# EAGLE design 2mos9 (EAGLE 5.10)
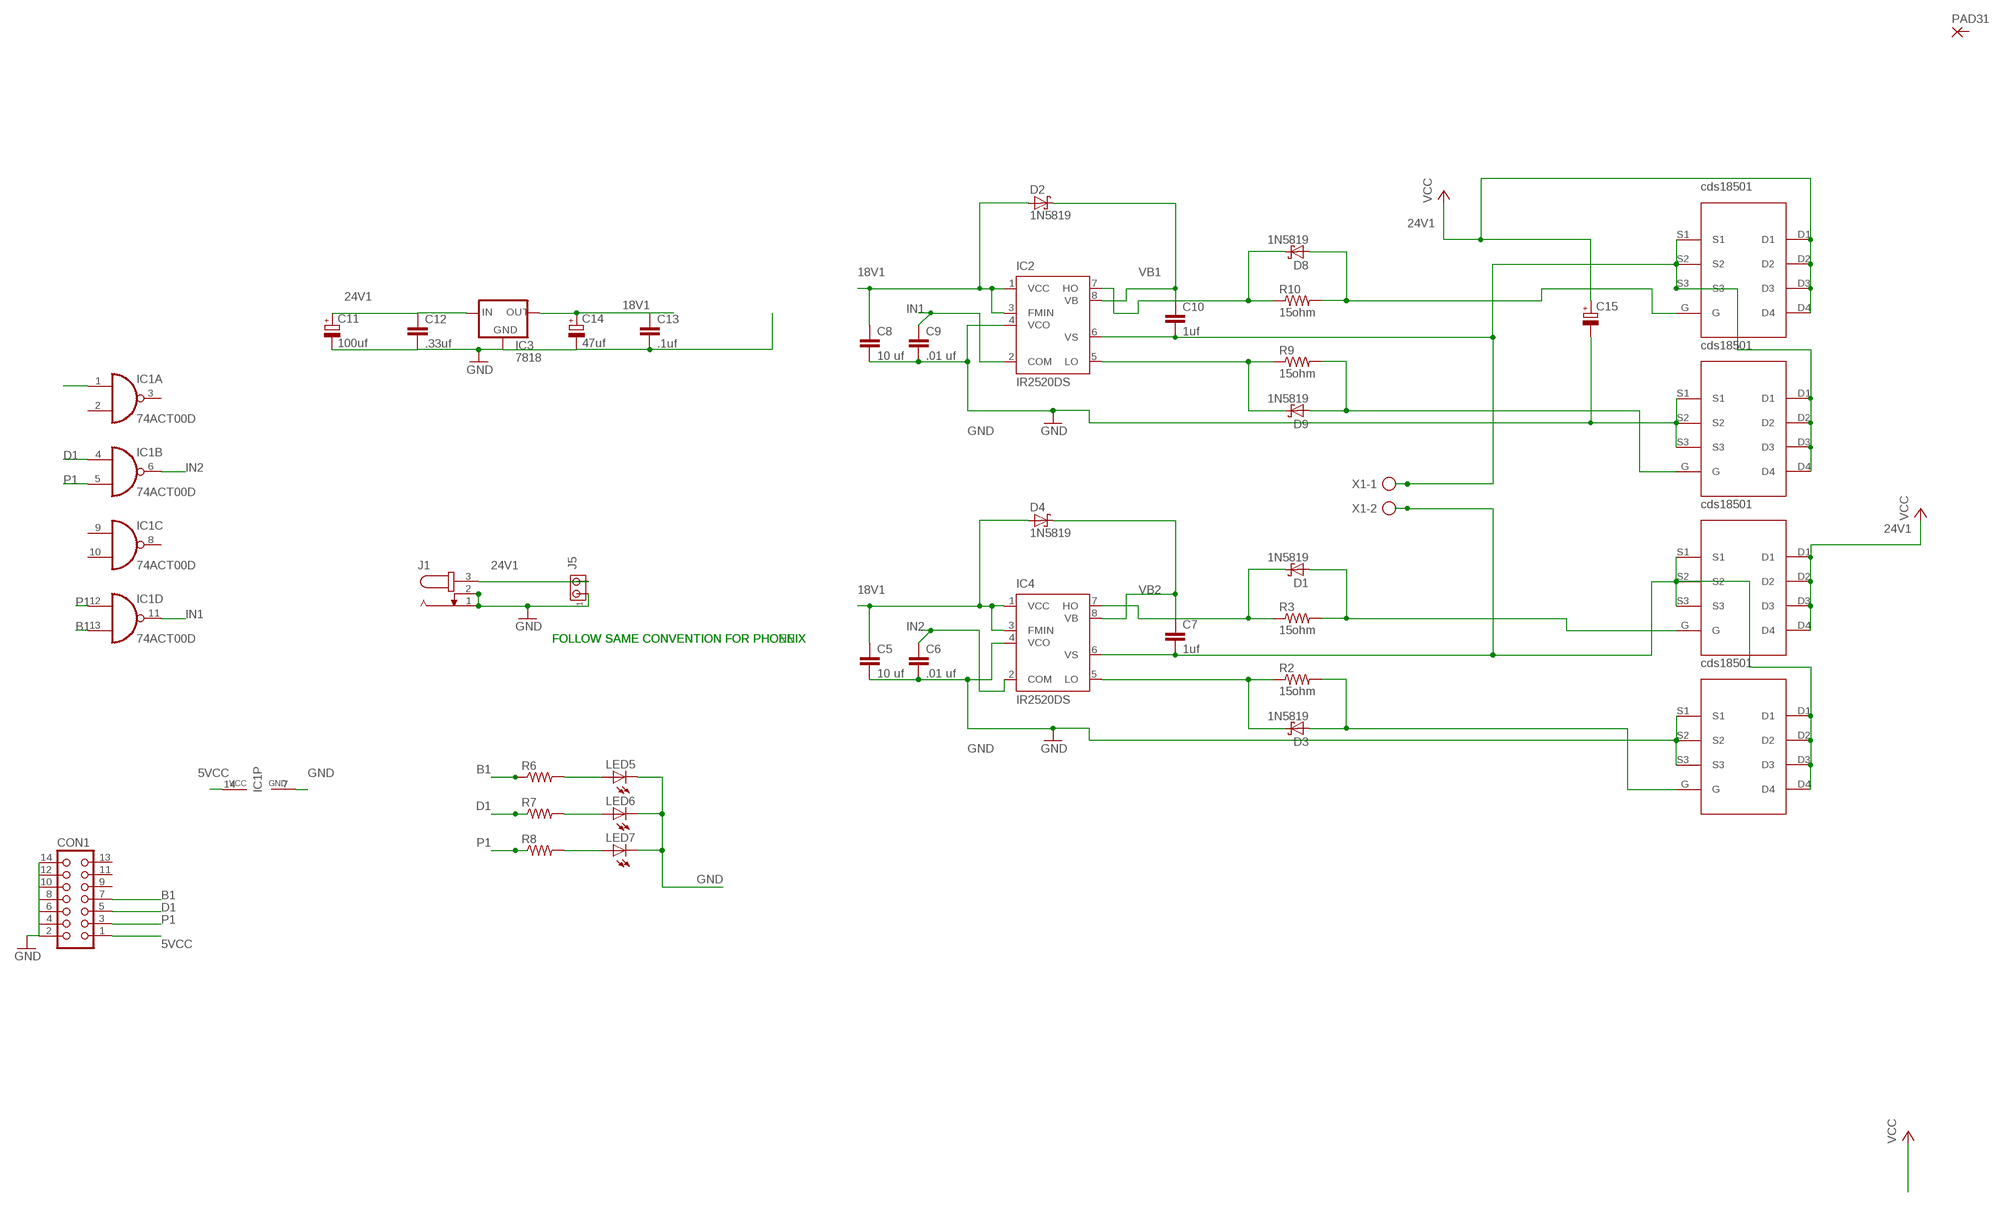
[diagram p0: schematic, sheet 1]

## Parts
C5  10 uf  C-EUC0603  [C0603]
C6  .01 uf  C-EUC0603  [C0603]
C7  1uf  C-EUC0603  [C0603]
C8  10 uf  C-EUC0603  [C0603]
C9  .01 uf  C-EUC0603  [C0603]
C10  1uf  C-EUC0603  [C0603]
C11  100uf  CPOL-EUE2.5-7  [E2,5-7]
C12  .33uf  C-EUC0603  [C0603]
C13  .1uf  C-EUC0603  [C0603]
C14  47uf  CPOL-EUE2.5-7  [E2,5-7]
C15  CPOL-EUE3.5-10  [E3,5-10]
CON1  CON14L  [CON14L]
D1  1N5819  SCHOTTKY-DIODESMD  [SMB]
D2  1N5819  SCHOTTKY-DIODESMD  [SMB]
D3  1N5819  SCHOTTKY-DIODESMD  [SMB]
D4  1N5819  SCHOTTKY-DIODESMD  [SMB]
D8  1N5819  SCHOTTKY-DIODESMD  [SMB]
D9  1N5819  SCHOTTKY-DIODESMD  [SMB]
IC1  74ACT00D  [SO14]
IC2  IR2520DS  [SO08]
IC3  7818  78XXS  [78XXS]
IC4  IR2520DS  [SO08]
J1  JACK-PLUG1  [SPC4078]
J5  MTA02-100  [10X02MTA]
LED5  LEDCHIPLED_0603  [CHIPLED_0603]
LED6  LEDCHIPLED_0603  [CHIPLED_0603]
LED7  LEDCHIPLED_0603  [CHIPLED_0603]
PAD31  1,6/0,8HOLE00  [1,6/0,8]
R2  15ohm  R-US_R0603  [R0603]
R3  15ohm  R-US_R0603  [R0603]
R6  R-US_R0603  [R0603]
R7  R-US_R0603  [R0603]
R8  R-US_R0603  [R0603]
R9  15ohm  R-US_R0603  [R0603]
R10  15ohm  R-US_R0603  [R0603]
U$1  CSD18503GDS-NEW  [CDS]
U$2  CSD18503GDS-NEW  [CDS]
U$3  CSD18503GDS-NEW  [CDS]
U$4  CSD18503GDS-NEW  [CDS]
X1  AK300/2  [AK300/2]

## Nets
5VCC: CON1.1 IC1.14(P:VCC)
18V1: C5.1 C8.1 C13.1 C14.+ D2.A D4.A IC2.1(VCC) IC2.3(FMIN) IC3.OUT IC4.1(VCC) IC4.3(FMIN)
24V1: C11.+ C12.1 C15.+ IC3.IN J1.3 J5.2 U$1.D1 U$1.D2 U$1.D3 U$1.D4 U$3.D1 U$3.D2 U$3.D3 U$3.D4 ; supply symbol labelled VCC
B1: CON1.7 IC1.13(D:I1) R6.1
D1: CON1.5 IC1.4(B:I0) R7.1
GND: C5.2 C6.2 C8.2 C9.2 C11.- C12.2 C13.2 C14.- C15.- CON1.2 CON1.4 CON1.6 CON1.8 CON1.10 CON1.12 CON1.14 IC1.7(P:GND) IC2.4(VCO) IC3.GND IC4.4(VCO) J1.1 J1.2 J5.1 LED5.C LED6.C LED7.C U$2.S1 U$2.S2 U$2.S3 U$4.S1 U$4.S2 U$4.S3
IN1: C9.1 IC1.11(D:O) IC2.2(COM)
IN2: C6.1 IC1.6(B:O) IC4.2(COM)
N$1: IC1.1(A:I0)
N$2: D3.C IC4.5(LO) R2.1
N$4: C7.2 IC4.6(VS) U$3.S1 U$3.S2 U$3.S3 U$4.D1 U$4.D2 U$4.D3 U$4.D4 X1.2
N$12: D8.A R10.2 U$1.G
N$13: D1.C IC4.7(HO) R3.1
N$14: D1.A R3.2 U$3.G
N$15: D3.A R2.2 U$4.G
N$17: C10.2 IC2.6(VS) U$1.S1 U$1.S2 U$1.S3 U$2.D1 U$2.D2 U$2.D3 U$2.D4 X1.1
N$23: D9.C IC2.5(LO) R9.1
N$24: D9.A R9.2 U$2.G
N$25: D8.C IC2.7(HO) R10.1
N$33: LED5.A R6.2
N$34: LED6.A R7.2
N$35: LED7.A R8.2
P1: CON1.3 IC1.5(B:I1) IC1.12(D:I0) R8.1
VB1: C10.1 D2.C IC2.8(VB)
VB2: C7.1 D4.C IC4.8(VB)
Unconnected: CON1.9 CON1.11 CON1.13 IC1.2(A:I1) IC1.3(A:O) IC1.8(C:O) IC1.9(C:I0) IC1.10(C:I1) PAD31.1(P)

## Notes on the sheet
- FOLLOW SAME CONVENTION FOR PHOENIX | FOLLOW SAME CONVENTION FOR PHONEIX

## Library data of the parts
C5-C10 C12 C13 = rcl:C-EU: CAPACITOR, European symbol
C11 C14 = resistor:CPOL-EU: POLARIZED CAPACITOR, European symbol
C15 = rcl:CPOL-EU: POLARIZED CAPACITOR, European symbol
CON1 = con-harting:CON14L: CONNECTOR
D1-D4 D8 D9 = diode:SCHOTTKY-DIODE: Schottky Diode
IC1 = 74xx-eu:74*00: Quad 2-input NAND gate
IC2 IC4 = ir:IR2520D: ADAPTIVE BALLAST CONTROL IC The IR2520D(S) is a complete adaptive ballast controller and 600V half-bridge driver integrated into a single IC for fluorescent lighting applications. Data Sheet No. PD60212 Rev A Source: www.irf.com .. ir2520.pdf
IC3 = v-reg:78XXS: VOLTAGE REGULATOR
J1 = con-jack:JACK-PLUG: DC POWER JACK Power Jack, DC, Right Angle, Through Hole, Rated 5A at 16VDC, PC Terminals Distributor: Farnell (www.Farnell.de) Drawing: 84N1161.pdf / 84N1162.pdf Manufacturer: SPC Technology (www.spctechnology.com) Type: SPC4077 / SPC 4078
J5 = con-amp:MTA02-100: AMP connector
LED5-LED7 = led:LED: LED OSRAM: - CHIPLED LG R971, LG N971, LY N971, LG Q971, LY Q971, LO R971, LY R971 LH N974, LH R974 LS Q976, LO Q976, LY Q976 LO Q996 - Hyper CHIPLED LW Q18S LB Q993, LB Q99A, LB R99A - SideLED LS A670, LO A670, LY A670, LG A670, LP A670 LB A673, LV A673, LT A673, LW A673 LH A674 LY A675 LS A676, LA A676, LO A676, LY A676, LW A676 LS A679, LY A679, LG A679 - Hyper Micro SIDELED® LS Y876, LA Y876, LO Y876, LY Y876 LT Y87S - SmartLED LW L88C, LW L88S LB L89C, LB L89S, LG L890 LS L89K, LO L89K, LY L89K LS L896, LA L896, LO L896, LY L896 - TOPLED LS T670, LO T670, LY T670, LG T670, LP T670 LSG T670, LSP T670, LSY T670, LOP T670, LYG T670 LG T671, LOG T671, LSG T671 LB T673, LV T673, LT T673, LW T673 LH T674 LS T676, LA T676, LO T676, LY T676, LB T676, LH T676, LSB T676, LW T676 LB T67C, LV T67C, LT T67C, LS T67K, LO T67K, LY T67K, LW E67C LS E67B, LA E67B, LO E67B, LY E67B, LB E67C, LV E67C, LT E67C LW T67C LS T679, LY T679, LG T679 LS T770, LO T770, LY T770, LG T770, LP T770 LB T773, LV T773, LT T773, LW T773 LH T774 LS E675, LA E675, LY E675, LS T675 LS T776, LA T776, LO T776, LY T776, LB T776 LHGB T686 LT T68C, LB T68C - Hyper Mini TOPLED® LB M676 - Mini TOPLED Santana® LG M470 LS M47K, LO M47K, LY M47K Source: http://www.osram.convergy.de LUXEON: - LUMILED® LXK2-PW12-R00, LXK2-PW12-S00, LXK2-PW14-U00, LXK2-PW14-V00 LXK2-PM12-R00, LXK2-PM12-S00, LXK2-PM14-U00 LXK2-PE12-Q00, LXK2-PE12-R00, LXK2-PE12-S00, LXK2-PE14-T00, LXK2-PE14-U00 LXK2-PB12-K00, LXK2-PB12-L00, LXK2-PB12-M00, LXK2-PB14-N00, LXK2-PB14-P00, LXK2-PB14-Q00 LXK2-PR12-L00, LXK2-PR12-M00, LXK2-PR14-Q00, LXK2-PR14-R00 LXK2-PD12-Q00, LXK2-PD12-R00, LXK2-PD12-S00 LXK2-PH12-R00, LXK2-PH12-S00 LXK2-PL12-P00, LXK2-PL12-Q00, LXK2-PL12-R00 Source: www.luxeon.com KINGBRIGHT: KA-3528ASYC Source: www.kingbright.com
PAD31 = hole00:1,6/0,8: THROUGH-HOLE PAD
R2 R3 R6-R10 = rcl:R-US_: RESISTOR, American symbol
U$1-U$4 = cds_new:CSD18503GDS-NEW
X1 = con-ptr500:AK300/2: CONNECTOR

## Board
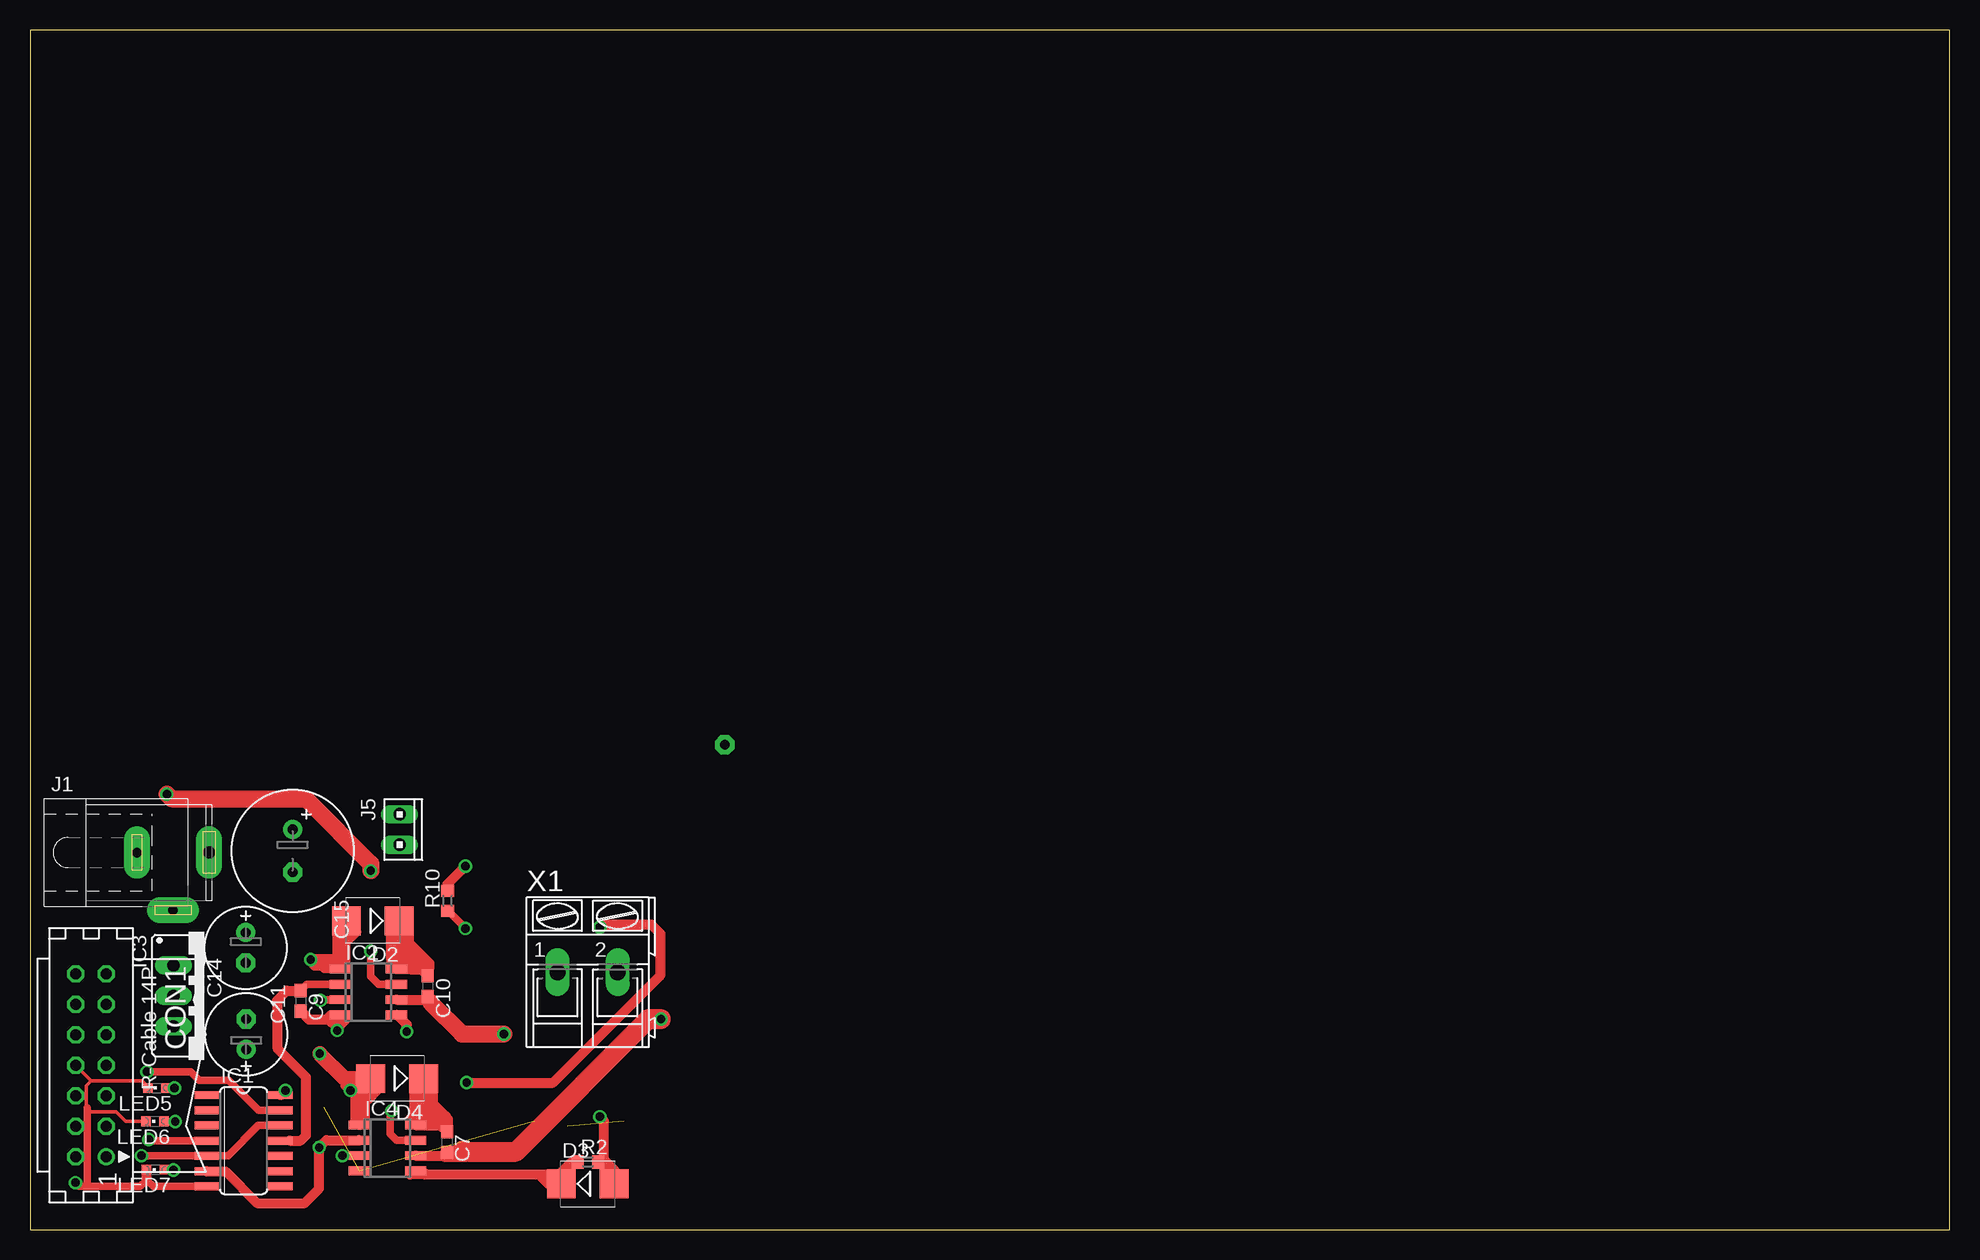
[diagram p1: board, top side]
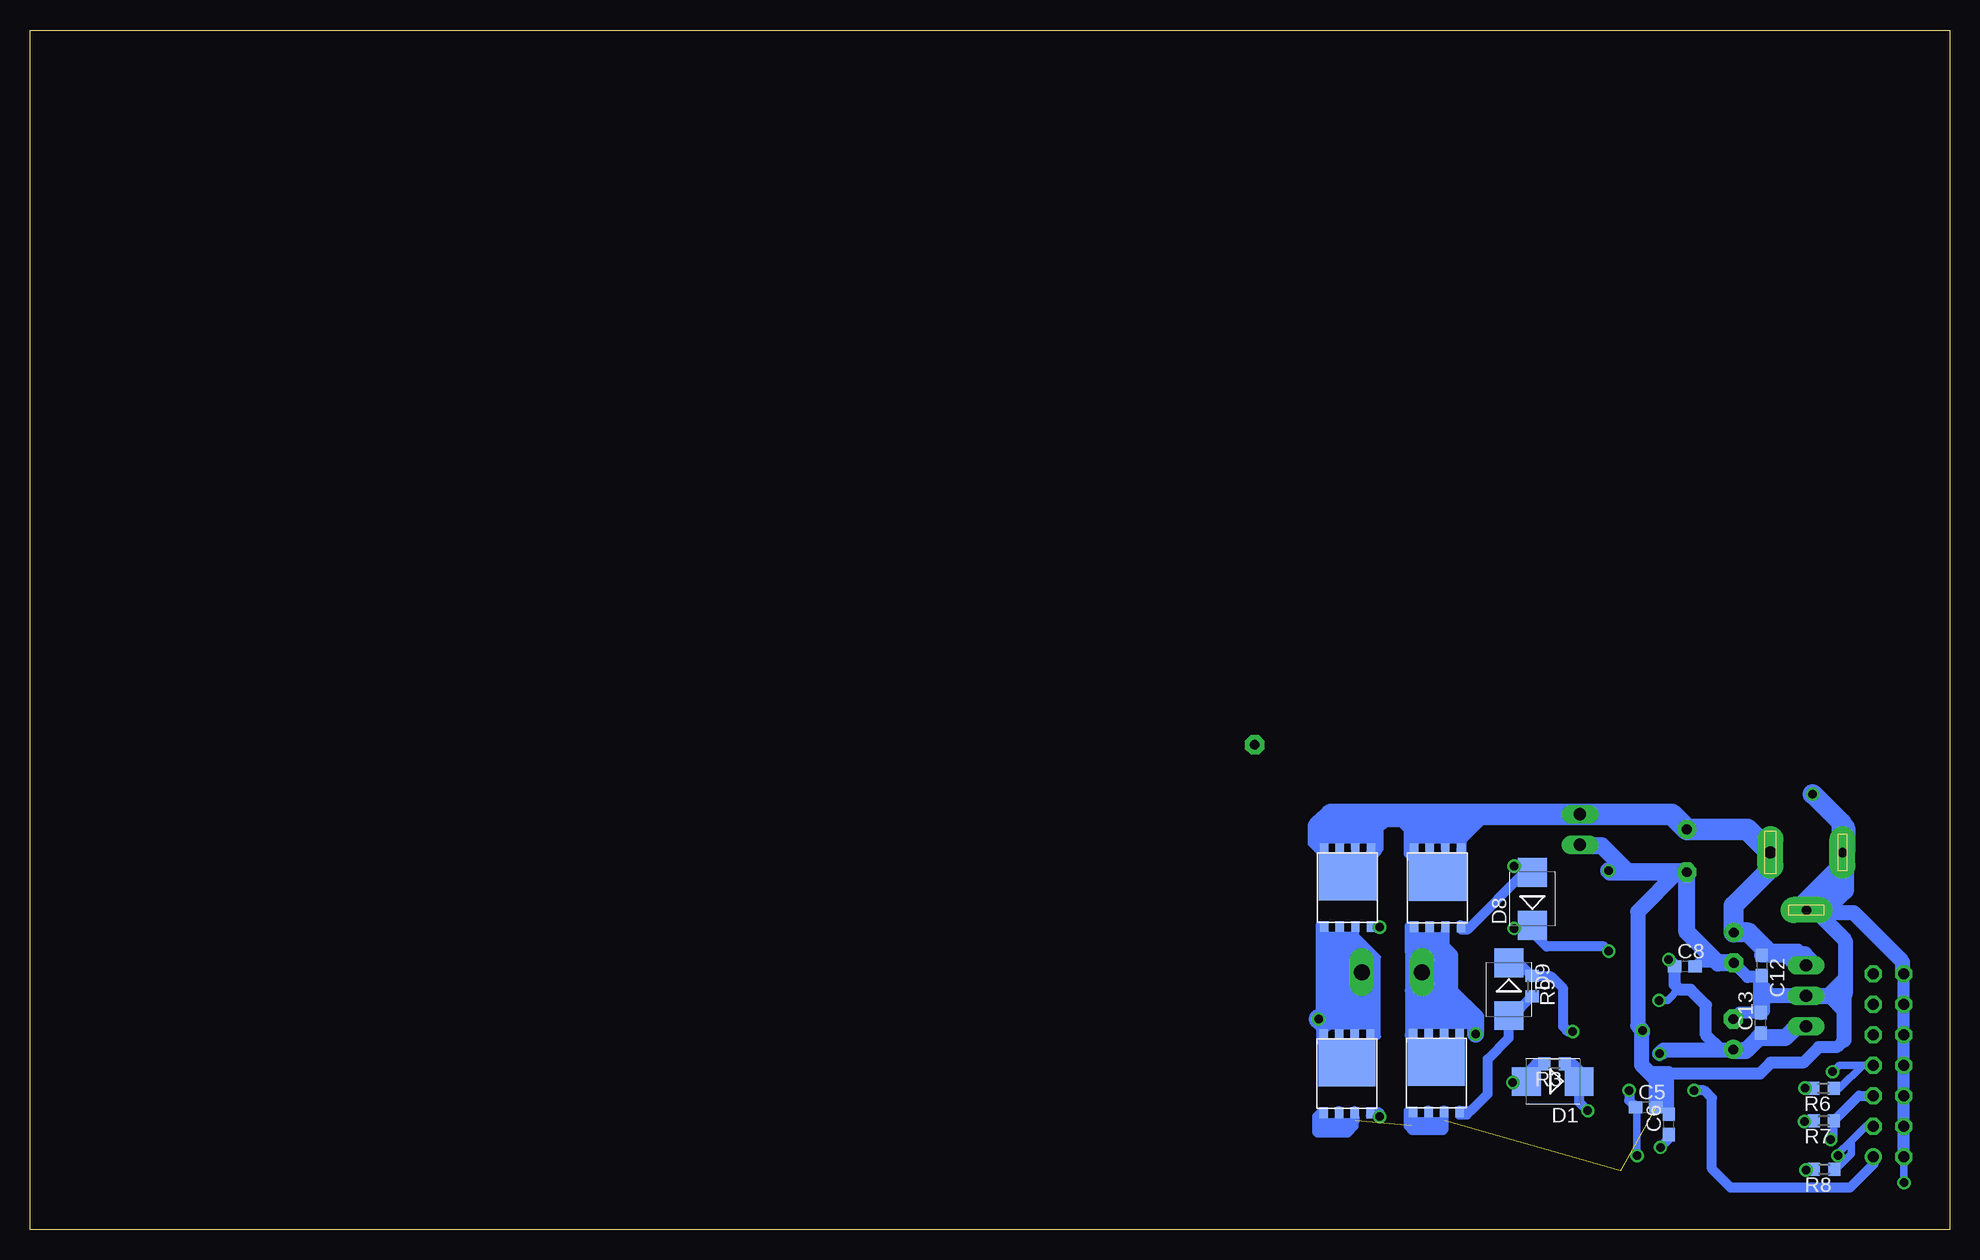
[diagram p2: board, bottom side, seen from below]

Size 160 x 100 mm. Coordinates in mm from the lower left corner, seen from the top.
Outline: 0,0 160,0 160,100 0,100 0,0
Copper layers (1*16): Top 0.035mm / dielectric 1.5mm / Bottom 0.035mm
Design rules "default": minimum track width 10mil, minimum drill 24mil, track to track 8mil, track to pad 8mil, pad to pad 8mil, via to via 8mil, smd to smd 8mil, copper to edge 40mil, drill to drill 8mil, minimum pad ring 10mil, minimum via ring 8mil, stop-mask expansion 4mil, vias tented up to drill 0mil, thermal gap 10mil

### Footprints (pad centres in the part's own frame; a part is rotated, then mirrored left to right if it is on the bottom)
C0603 = smd 1.1 x 1: 1 -0.85,0; 2 0.85,0
E2,5-7 = drill 0.813 pad 1.6 round: + -1.27,0 | drill 0.813 pad 1.6 octagon: - 1.27,0
E3,5-10 = drill 0.813 pad 1.6 round: + -1.778,0 | drill 0.813 pad 1.6 octagon: - 1.778,0
CON14L = drill 0.914 round: 1 7.62,1.27 | drill 0.914 octagon: 2 7.62,-1.27; 3 5.08,1.27; 4 5.08,-1.27; 5 2.54,1.27; 6 2.54,-1.27; 7 0,1.27; 8 0,-1.27; 9 -2.54,1.27; 10 -2.54,-1.27; 11 -5.08,1.27; 12 -5.08,-1.27; 13 -7.62,1.27; 14 -7.62,-1.27
SMB = smd 2.4 x 2.4: A 2.2,0; C -2.2,0
SO14 = smd 0.66 x 2.032: 1 -3.81,-3.073; 2 -2.54,-3.073; 3 -1.27,-3.073; 4 0,-3.073; 5 1.27,-3.073; 6 2.54,-3.073; 7 3.81,-3.073; 8 3.81,3.073; 9 2.54,3.073; 10 1.27,3.073; 11 0,3.073; 12 -1.27,3.073; 13 -2.54,3.073; 14 -3.81,3.073
SO08 = smd 0.72 x 1.78: 1 -1.905,-2.35; 2 -0.635,-2.35; 3 0.635,-2.35; 4 1.905,-2.35; 5 1.905,2.35; 6 0.635,2.35; 7 -0.635,2.35; 8 -1.905,2.35
78XXS = drill 1.016 long: GND 0,-2.54; IN -2.54,-2.54; OUT 2.54,-2.54
SPC4078 = drill 0.8 pad 2.184 long: 1 -3,0; 2 0,-4.8 | drill 1 pad 2.184 long: 3 3,0
10X02MTA = drill 1.016 long: 1 1.27,0; 2 -1.27,0
CHIPLED_0603 = smd 0.8 x 0.8: A 0,-0.75; C 0,0.75
1,6/0,8 = drill 0.813 pad 1.6 octagon: 1 0,0
R0603 = smd 1 x 1.1: 1 -0.85,0; 2 0.85,0
CDS = smd 0.406 x 0.203: D1 1,-0.9; D2 1,0.4; D3 1,1.7; D4 1,3; G 7.1,2.9; P$1 7.2,3.1; P$2 7.2,2.9; P$3 7.2,2.7; P$4 7.5,1.9; P$5 7.6,3.1; P$6 7.6,2.9; P$7 7.6,2.7; P$8 7.6,1.9; P$9 7.1,3.1; P$11 7.1,2.7; P$12 7.5,1.7; P$13 7.2,-1.1; P$14 7.6,-1.1; P$16 7.6,-0.9; P$17 7.1,-0.9; P$18 7.1,-1.1; P$19 7.1,-0.7; P$20 7.5,-0.7; P$21 7.6,-0.7; P$22 7.1,-1.2; P$23 7.5,-1.2; P$24 7.6,-1.2; P$25 7.1,3.2; P$26 7.5,3.2; P$27 7.6,3.2; P$28 7.1,0.1; P$30 7.1,0.5; P$31 7.1,0.6; P$32 7.1,1.4; P$34 7.1,1.8; P$35 7.1,1.9; P$36 7.6,1.7; P$37 7.5,1.5; P$38 7.6,1.5; P$39 7.5,1.4; P$40 7.6,1.4; P$41 7.5,0.6; P$42 7.6,0.6; P$43 7.5,0.4; P$44 7.6,0.4; P$45 7.5,0.2; P$46 7.6,0.2; P$47 7.5,0.1; P$48 7.6,0.1; P$68 1,3.2; P$69 0.6,3.2; P$70 0.6,3; P$72 1.1,3.2; P$73 1.2,3; P$74 0.6,2.8; P$75 1,2.8; P$76 1.1,2.8; P$77 0.6,2.7; P$78 1,2.7; P$79 1.1,2.7; P$80 1.1,1.9; P$81 0.7,1.9; P$82 0.6,1.9; P$83 0.6,1.7; P$85 1.1,1.7; P$86 0.6,1.5; P$87 1,1.5; P$88 1.2,1.5; P$89 0.6,1.4; P$90 1,1.4; P$91 1.2,1.4; P$92 0.6,0.6; P$93 1,0.6; P$94 1.1,0.6; P$95 0.6,0.4; P$97 1.2,0.4; P$98 0.6,0.2; P$99 1,0.2; P$100 1.2,0.2; P$101 0.6,0.1; P$102 1,0.1; P$103 1.1,0.1; P$104 0.6,-0.7; P$105 0.9,-0.7; P$106 1.1,-0.7; P$107 0.6,-0.9; P$109 1.1,-0.9; P$110 0.6,-1.1; P$111 1.1,-1.1; P$112 1,-1.1; P$113 0.6,-1.2; P$114 1,-1.2; P$115 1.1,-1.2; S1 7.2,-0.9; S2 7.1,0.3; S3 7.1,1.6 | smd 1.93 x 0.965: P$49 4.2,-0.9; P$50 2.3,-0.9; P$51 2.3,0; P$52 4.2,0; P$53 4.2,0.9; P$54 2.3,0.9; P$55 4.2,1.8; P$56 2.3,1.8; P$57 2.3,2.7; P$58 4.2,2.7; P$59 4.2,2.9; P$60 2.3,2.9; P$61 2.2,2.9; P$62 2.2,1.9; P$63 2.2,2; P$64 2.2,1; P$65 2.2,0; P$66 2.2,0.1; P$67 2.2,-0.9
AK300/2 = drill 1.321 long: 1 -2.515,0; 2 2.489,0

### Placement (x,y rotation side)
C5  25.31,10.2 0 bottom
C6  23.4,8.76 90 bottom
C7  34.75,7.3 270 top
C8  22.06,21.95 0 bottom
C9  22.55,19.06 270 top
C10  33.15,20.29 270 top
C11  17.98,23.49 270 top
C12  15.65,22.01 270 bottom
C13  15.75,17.23 90 bottom
C14  18.02,16.28 90 top
C15  21.89,31.57 270 top
CON1  5.08,13.69 270 top
D1  33.07,12.34 180 bottom
D2  28.57,25.74 180 top
D3  46.49,3.81 0 top
D4  30.6,12.59 180 top
D8  34.76,27.56 90 bottom
D9  36.74,20.03 270 bottom
IC1  17.8,7.4 270 top
IC2  28.2,19.8 270 top
IC3  14.5,19.49 270 top
IC4  29.8,6.8 270 top
J1  11.92,31.43 0 top
J5  30.8,33.35 270 top
LED5  10.57,11.8 90 top
LED6  10.42,9.02 90 top
LED7  10.47,4.99 90 top
PAD31  57.91,40.41 0 top
R2  46.5,5.63 0 top
R3  32.93,13.82 180 bottom
R6  10.51,11.77 180 bottom
R7  10.48,9.07 180 bottom
R8  10.45,5.02 180 bottom
R9  34.8,20.28 270 bottom
R10  34.8,27.4 90 top
U$1  43.67,32.58 270 bottom
U$2  43.77,17.14 270 bottom
U$3  51.17,32.6 270 bottom
U$4  51.22,17.09 270 bottom
X1  46.49,21.45 0 top

### Tracks (layer width: path | path; a pad name or v marks a point on that pad's centre or on a via)
5VCC  (via drill 0.7)
  Top 0.813: v21.3,11.6 20.91,11.21 IC1.14
  Bottom 0.813: v21.3,11.6 20.45,11.6 19.8,10.95 19.8,5.05 18.25,3.5 8.3,3.5 6.35,5.45 CON1.1
18V1  (via drill 0.7)
  Top 0.61: D2.A 27.3,24.81 27.3,24.8 26.4,23.9 26.4,22 26.2,22.2 25.2,22.2 25.5,22.5 25.5,22.6 25.5,24.6 25.7,24.4 26.4,24.4 25.9,23.9 25.9,22.6 25.85,22.55 IC2.1 24.5,21.7 24.3,21.9 23.7,21.9 23.3,22.3 | IC2.3 24.27,19.16 v24.2,19.1 | IC4.3 27.43,6.15 v26.05,6.15
  Top 0.813: v26.7,11.6 27.2,12.1 26.71,12.59 26.21,12.59 27.2,11.6 27.2,11.25 27.1,11.15 27.1,9 27.7,9.6 27.7,10.6 27.3,11 | IC4.1 27.45,10.7 27.85,11.1 27.85,8.85 27.9,8.8 27.9,10.85 28.55,11.5 28.55,11.25 | 28.55,11.25 27.65,10.35 | 28.55,11.25 29,11.7 28,11.7 27.3,11 | 27.3,11 26.3,12
  Top 1.016: v23.4,22.5 25.4,22.5 25.5,22.6
  Top 1.27: D4.A 26.21,12.59 v24.15,14.65
  Bottom 0.406: 15.9,16 15.9,16.23 C13.1
  Bottom 0.61: v24.2,19.1 23.5,19.1 22.55,20.05 | v26.05,6.15 26.05,10.09 arc-90 26.5,10.54
  Bottom 0.813: v26.7,11.6 26.7,10.74 26.5,10.54 C5.1
  Bottom 1.016: v23.4,22.5 22.91,22.01 C8.1 22.9,20.4 22.55,20.05 22.5,20 21.6,20 20.3,18.7 20.3,16.2 19.11,15.01 C14.+
  Bottom 1.27: v24.15,14.65 23.85,14.95 18.08,14.95 C14.+
  Bottom 1.422: IC3.OUT 12.75,16.95 13.7,16 15.9,16 17,14.9 17.91,14.9 C14.+
24V1
  Bottom 0.305: 45.1,33.2 45.6,33.7 | 45.6,33.7 45.8,33.9 | 45.8,33.9 46,33.9 | 45.8,33.9 45.7,33.9 45.6,33.8 45.6,33.7 | 45.6,33.7 45.8,33.7 | 46.9,33.7 47.8,33.7 47.4,33.3 47.4,31.6 47.3,31.7 47.3,33.3 46.9,33.7 | 46.8,33.7 46.9,33.7 | 46.8,33.7 46.7,33.8 45.4,33.8 45.5,33.7 45.6,33.7 | 45.8,33.7 46.8,33.7 | 45.8,33.7 45.3,33.2 44.7,33.8 44.5,33.8
  Bottom 0.61: 43.3,32.6 43.27,32.57 U$1.D2 | U$1.D3 42.1,31.71 42.1,32.6 | U$1.D1 44.85,31.86 44.85,31.95 | U$3.D3 49.6,31.73 49.6,32.6 | U$3.D2 50.8,31.63 50.8,32.6 | U$3.D1 52.6,31.6 53.2,32.2 53.2,33.4 52.75,33.85 52.35,33.85 | 45.1,31.7 45.2,31.6 45.2,31.3 44.9,31 44.8,31.1 44.6,31.1 44.6,32.5 | 44.5,32.6 44.5,33.8 44.2,34.1 41,34.1 41,32.8 40.8,32.6 40.6,32.6 39.1,34.1 38.9,34.1 40.4,32.6 41.5,32.6 40.5,33.6 40.1,33.6 40.6,33.1 41.1,33.6 41.4,33.6 41.5,33.5 41.5,33.2 41.9,33.6 | 41.9,33.6 41.9,33.7 | 41.9,33.6 41.9,33 42,33.1 44.1,33.1 44,33.2 44,33.8 43.9,33.7 42.1,33.7 | 42.1,34.62 42.72,34 45.4,34 45.2,33.8 45.2,31.8 44.8,32.2 | 44.8,32.2 44.8,33.6 45.3,34.1 45.9,34.1 45.7,33.9 45.1,33.3 | 45.1,33.3 45.1,33.2 45.1,32.5 44.8,32.2 | 45.1,33.3 45.1,33.8 45.4,34.1 46.9,34.1 47.5,33.5 | 47.5,33.5 47.6,33.4 47.6,33.3 47.5,33.2 | 47.5,33.2 47.5,33.4 | 47.5,33.5 47.5,33.4 | 47.5,32.8 47.5,33.2 | 47.5,32.8 47.8,33.1 47.8,33.7 47.9,33.6 51.4,33.6 51.6,33.4 51.6,33.1 51.4,33.3 48.1,33.3 47.4,34 46.9,34 47.5,33.4 | 47.5,32.8 47.5,32.7 47.7,32.5 47.7,32.2
  Bottom 0.813: U$1.D4 40.7,31.61 40.7,32.4 40.9,32.6 41.5,32.6 42.1,32.6 43.3,32.6 44.5,32.6 | 44.5,32.6 44.6,32.6 45.1,32.1 45.1,31.7 44.85,31.95 44.7,32.1 44.7,32.4 44.6,32.5 44.5,32.6 | 52.6,32.5 52.5,32.6 50.8,32.6 49.6,32.6 48.1,32.6 47.7,32.2 47.7,31.6 48.17,31.13 | 48.17,31.13 48.2,31.1 | 48.17,31.13 U$3.D4 | 15.4,23.4 12.6,23.4 12.1,22.9
  Bottom 1.27: C12.1 12.34,22.86 12.3,22.9
  Bottom 1.422: 12.3,22.9 12.1,22.9 11.2,22 12.7,22 12.7,22.8 12.6,22.9 12.6,22.3 12.8,22.1 12.8,22.2 13.3,22.7 12.63,22.7 IC3.IN
  Bottom 1.676: J1.3 14.9,31.41 14.9,30.1 17.98,27.02 C11.+ 16.76,24.76 15.4,23.4
  Bottom 1.778: J1.3 16.84,33.35 C15.+ 23.16,34.62 J5.2 42.1,34.62 51.58,34.62 52.35,33.85 52.6,33.6 52.6,32.5
B1  (via drill 0.7)
  Top 0.61: IC1.13 19.05,9.95 16.55,12.45 14.1,12.45 13.4,13.15 v9.75,13.15
  Bottom 0.61: CON1.7 6.85,13.7 7.25,13.7 | 7.25,13.7 9.18,11.77 R6.1 | v9.75,13.15 9.2,13.7 7.25,13.7
D1  (via drill 0.7)
  Top 0.61: IC1.4 10,7.4 v9.9,7.5
  Bottom 0.61: v9.9,7.5 9.63,7.77 R7.1
  Bottom 0.813: R7.1 7.55,11.15 CON1.5
GND  (via drill 0.7)  (3 unrouted)
  Top 0.305: CON1.8 5.1,12.4 | 5.1,12.4 4.7,12 4.7,10.2 4.75,10.15 5.1,9.8 7.2,9.8 7.98,9.02 LED6.C | 5.1,12.4 9.35,12.4 9.82,11.93 LED5.C
  Top 0.61: 9.75,4.25 9.75,4.96 LED7.C | 4.1,3.6 v3.8,3.9 4,3.9 4.3,3.6 9.2,3.6 9.72,4.12 10.25,3.59 IC1.7 | 4.75,10.15 4.75,3.95
  Top 0.813: IC2.4 25.09,17.89 24.7,17.5 | 24.7,17.5 23.26,17.5 C9.2 | 24.7,17.5 26.2,17.5 26.3,17.6 25.8,17.6 25.5,17.3 25.8,17.3 25.8,17 | 25.6,16.8 25.8,17 | 25.8,17 26.3,17.5 25.2,17.5 25.1,17.4 25.1,17.3 25.6,16.8 | v25.6,16.6 25.6,16.8 | 9.72,4.12 LED7.C
  Top 1.422: v28.4,29.9 28.4,30.5 23,35.9 11.8,35.9 v11.4,36.3
  Bottom 0.305: 8.7,33.5 9.3,32.9 9.3,28 10.2,27.1 11.4,27.1 8.6,24.3 8.6,19.6
  Bottom 0.61: v3.8,3.9 CON1.2 | U$2.S3 42.15,10.02 42.15,9.1 | 42.15,9.1 42.2,9.05 | 42.2,9.05 42.05,9.05 | 42.05,9.05 42.05,9.1 | 42.05,9.1 42.05,9.95 42.1,9.9 42.1,9.15 42.15,9.1 | 42.2,9.05 43.45,9.05 | 43.45,9.05 44.9,9.05 45.15,9.3 | 45.2,9.35 45.2,9.9 45.16,9.94 U$2.S1 | U$2.S2 43.45,10.02 43.45,9.05 | U$4.S1 52.2,9.81 52.2,9 50.9,9 | 50.9,9 49.55,9 49.5,9.05 49.5,9.35 | 49.5,9.35 49.62,9.47 U$4.S3 | U$4.S2 50.9,9.97 50.9,9 | 49.5,9.35 49.6,9.25 49.6,8.95 50.05,8.5 52.15,8.5 52.4,8.75 52.4,9.85 52.8,9.45 52.8,8.1 52.7,8 50.3,8 50.65,8.35 52.6,8.35 52.25,8 50.15,8 49.55,8.6 49.55,9.05 | 45.15,9.3 45.2,9.35 | 45.15,9.3 45.15,9.15 45.2,9.2 | 45.2,9.35 45.2,9.2 | 45.2,9.2 45.2,8.6 44.8,8.2 42.2,8.2 42.05,8.35 42.05,9.05 | 42.05,9.1 42.5,8.65 44.8,8.65
  Bottom 0.813: 15.45,20.05 15.7,19.8 | 15.75,21.06 C12.2 | 19.3,22.22 20.94,22.22 C8.2 | C6.2 23.4,12.65 23.05,13
  Bottom 1.016: CON1.2 CON1.4 CON1.6 CON1.8 CON1.10 CON1.12 CON1.14 | 15.75,21.06 16.82,21.06 C11.- | C13.2 17.49,18.08 C14.- | 8.8,15.8 9.4,15.2 10.9,15.2 12.2,13.9 14.9,13.9 15.8,13 23.05,13 23.4,13 | 8.6,19.6 8.9,19.3 8.9,18.2 10,19.3 10.7,19.3 10.9,19.5 11.7,19.5 11.8,19.4 | 11.8,19.4 12,19.4 | 11.8,19.4 9,19.4 | 25.6,16.4 25.5,16.5 25.5,16.6
  Bottom 1.27: 11,26.4 8,26.4 3.9,22.3 3.9,21.4 CON1.14 | 11,26.4 12.9,26.4 | 11,26.4 8.7,24.1 8.7,20.9 | 8.7,20.9 8.7,20.7 | 10.1,19.5 9.9,19.5 | 15.75,21.06 C13.2 15.6,18.23 15.6,19 15.5,19.1 15.5,20.1 15.45,20.05 14.89,19.49 IC3.GND 11.7,19.5 10.1,19.5 | v25.6,16.6 26,17 26,26.5 22.7,29.8 22.5,29.8 | 8.7,20.7 8.8,20.6 8.8,15.8 | 8.7,20.7 8.7,19.7 | 8.7,20.9 10.1,19.5 | 23.4,13 24.95,13 | 24.95,13 25.65,13.7 25.65,16.35 25.6,16.4 | C5.2 24.46,12.04 24.35,12.15 24.35,11.55 24,11.2 24,10.65 24.2,10.45 24.2,12.25 24.95,13
  Bottom 1.422: C11.- 19.3,22.22 21.89,24.81 C15.- 26.79,29.79 29,32 30.72,32 J5.1 | 22.5,29.8 28.3,29.8 v28.4,29.9
  Bottom 1.676: J1.1 8.92,29.63 J1.2 10.47,26.63 8.8,28.3 8.8,32.1 8.9,32.2 8.9,30.4 12.9,26.4 | v11.4,36.3 9,33.9 9,31.2 8.7,31.5 8.7,33.5
IN1
  Top 0.61: IC2.2 23.07,20.43 C9.1 | IC1.11 21.65,7.4
  Top 0.813: C9.1 21.41,19.91 20.82,19.32 20.65,19.15 | 20.65,19.15 20.6,19.1 | 21.65,7.4 22.55,7.4 23,7.85 23,12.7 20.65,15.05 20.65,19.15
IN2  (via drill 0.7)
  Top 0.813: IC1.6 16.3,4.85 18.95,2.2 22.9,2.2 24.1,3.4 v24.1,6.85 24.7,7.45 27.43,7.45 IC4.2
  Bottom 0.813: v24.1,6.85 23.4,7.55 C6.1
N$2
  Top 0.61: IC4.5 32.4,4.65 32.8,4.65 32.85,4.7 32.85,4.75 32.95,4.65
  Top 0.813: 32.95,4.65 32.9,4.6 | 32.9,4.6 31.65,4.6 | 32.9,4.6 42.4,4.6 | 42.4,4.6 43.2,4.6 | 42.4,4.6 43.19,3.81 D3.C 44.29,4.79 45.05,5.55 45.57,5.55 R2.1
N$4  (via drill 0.7)
  Top 0.61: 36.2,6.2 36.2,7.05 35.85,7.05 35.5,6.7 35.5,6.4 35.25,6.15 36.15,6.15 36.35,5.95 36.3,5.95 | 36.2,5.95 36.3,5.95 | 36.2,5.95 35.4,6.75 35.5,6.75 36.3,5.95 | 36.2,5.95 34.56,5.95 34.35,6.17
  Top 0.813: IC4.6 34.35,6.17 34.47,6.17 C7.2 34.75,6.25 34.8,6.2 | 36.2,6.2 36.5,6.5
  Top 1.676: 36.5,6.5 40.5,6.5 51.55,17.55 v52.6,17.55
  Bottom 0.406: U$3.S3 49.57,24.83 49.8,24.6 | 49.8,24.6 50.8,24.6 | 50.8,24.6 52.2,24.6 52.3,24.7 52.3,25.17 U$3.S1 | U$3.S2 50.87,24.67 50.8,24.6 | 49.8,24.6 49.6,24.6 49.4,24.8 49.4,24.5 47.6,22.7 47.6,16.1 47.7,16 48.13,16 U$4.D4 48.11,16.09 47.8,16.4 47.8,16.5 47.9,16.6 47.9,22.4 47.9,22.6 48.9,23.6 49,23.6 49.8,24.4 52.2,24.4 52.4,24.6 52.4,25.5 52.6,25.5 v52.6,17.55 52.6,15.7 52.4,15.5 52.4,15.81 U$4.D1
  Bottom 0.61: U$4.D1 52.12,16.52 52.2,16.6 52.2,17.2 51.8,17.6 | U$4.D3 49.52,18.72 49.7,18.9 50,19.2 | 50.7,19.3 50.6,19.2 50.6,20.8 50,21.4 49.7,21.4 49.5,21.2 49.5,19.7 50.4,19.7 50.4,20.4 49.9,20.9 49.9,19.8 | U$4.D2 50.82,20.48 50.7,20.6
  Bottom 0.813: 51.8,17.6 51.8,23.9 52.2,24.3 52.2,22.8 | 52.2,22.8 52.2,17.7 | 52.2,22.8 50.8,24.2 51.4,24.2 51.5,24.3 50.3,24.3 49.7,23.7 49.7,23.6 49.2,23.1 49.8,23.1 50.5,23.8 50.5,23.6 51.2,22.9 50.4,22.9 50.3,22.8 48.5,22.8 48.2,22.5 48,22.5 47.9,22.4 51.3,22.4 51.3,17.6 51.8,17.1 48.3,17.1 48.1,16.9 48.1,16.2 48.2,16.1 48.2,18.7 | 48.2,18.7 48.2,19.8 48.4,20 48.4,17.9 48.8,17.5 50.5,17.5 50.7,17.7 50.7,19.3 50.7,20.6 50.7,21.8 50.6,21.9 48.4,21.9 48.4,18.9 48.2,18.7 | 48.2,18.7 48.5,18.7 49.4,17.8 49.7,17.8 50.5,18.6 49.1,18.6 49,18.7 49,21.43 X1.2
  Bottom 1.422: 49.9,19.8 49.9,19.1 49.7,18.9
  Bottom 1.676: v52.6,17.55 52.55,17.55 52.2,17.2
N$12  (via drill 0.7)
  Top 0.813: R10.2 34.8,28.8 v36.3,30.3
  Bottom 0.61: U$1.G 40.77,24.97 40.7,24.9 40.7,25.1 40.4,25.4 40.4,25.3 | 40.4,25.3 40.4,25.1 | 40.4,25.3 40.3,25.4 40.3,25.3 40.1,25.1 40.2,25.1 40.4,24.9 40.5,24.9 40.6,25
  Bottom 0.813: 40.6,25 40.2,25 35.3,29.9 34.9,29.9 D8.A 35.3,30.3 v36.3,30.3
N$13  (via drill 0.7)
  Top 0.61: IC4.7 32.13,7.45 30.55,7.45 30,8 30,9.65 30.05,9.7 30.05,9.75 30.1,9.8 30.1,9.85 v30.15,9.9
  Bottom 0.61: v30.15,9.9 30.6,10.35
  Bottom 0.813: 30.6,10.35 30.87,10.62 D1.C 30.87,13.32 31.4,13.85 32.05,13.85 R3.1
N$14  (via drill 0.7)
  Top 0.813: v36.4,12.25 43.6,12.25 52.55,21.2 52.55,24.65 51.8,25.4 47.7,25.4 v47.5,25.2
  Bottom 0.406: 35.15,13.15 35.5,13.15 v36.4,12.25 | 47.8,25.15 47.8,25.35 47.65,25.5 U$3.G
  Bottom 0.813: R3.2 34.48,13.82 35.15,13.15 35.15,12.46 D1.A | v47.5,25.2 47.75,25.2 47.8,25.15
N$15  (via drill 0.7)
  Top 0.813: R2.2 47.82,5.63 48.4,5.05 48.4,4.1 D3.A 48.69,4.96 47.85,5.8 47.85,9.05 v47.5,9.4
  Bottom 0.406: 47.55,9.75 47.55,9.9 47.65,10 48.15,9.5 | 48.15,9.5 48.45,9.5 | 48.15,9.5 48.1,9.5 47.6,10 U$4.G
  Bottom 0.813: v47.5,9.4 47.5,9.7 47.55,9.75
N$17  (via drill 0.7)
  Top 0.813: IC2.6 32.88,19.16 C10.2
  Top 1.016: C10.2 33.1,19.39 33.1,19.2 33.4,18.9
  Top 1.422: 33.4,18.9 36,16.3 v39.5,16.3
  Bottom 0.254: 42,25 42.07,25.07 U$1.S3 | U$1.S2 43.4,25.45 43.4,24.5
  Bottom 0.61: 44.4,17.4 44.8,17.4 44.9,17.4 45,17.3 45,16.47 U$2.D1 44.9,16.37 44.9,16.4 45,16.3 45,16 44.9,15.9 44.9,15.7 44.7,15.9 44.7,17.3 43,19 43,21.3 43,21.4 | 39.2,17.6 39.2,17.3 39.2,17 42.8,20.6 42.8,20.8 41.1,19.1 41.1,18.1 41.3,18.3 42.7,18.3 42.7,20 41.6,18.9 41.6,18.7 41.7,18.8 42.3,18.8 42.3,19.2 42,19.5 42,23.8 | U$1.S1 45.02,25.38 45.1,25.3 45.1,24.8 44.8,24.5 43.4,24.5 42.2,24.5 42.1,24.4 42.1,24.9 42,25 42,23.8 | 42.5,23.3 42,23.8 | 42.5,23.3 42.5,21.2 | 42.5,24 42.5,23.3 | 40.9,16.27 U$2.D4 | 40.9,17.4 40.9,16.27 | 40.9,16.27 40.8,16.37 40.8,17.4 41,17.6 41,18.1 43,18.1 | U$2.D3 42.1,16.17 42.1,17.4 | U$2.D2 43.5,16.27 43.5,17.4
  Bottom 0.813: 39.2,17.6 41.4,19.8 41.4,20 39.2,17.8 39.2,17.3 41.4,19.5 41.4,23 42.3,23.9 42.3,20.9 42.4,20.8 | 42.4,20.8 42.4,20.9 43.1,21.6 43.1,21.5 | 42.4,20.8 42.4,19.6 43.8,21 43.8,22.8 43,22 43,21.3 43.1,21.4 | 43.1,21.5 42.4,20.8 | 43.1,21.4 43.1,21.5 | 43.1,21.4 44.2,22.5 44.2,21.2 43.5,21.2 43.4,21.3
  Bottom 1.016: 42.5,24 42.6,23.9 43.5,23.9 43,23.4 43,22.5 43.4,22.1 43.4,21.9 43.2,21.7 43,21.7 43.1,21.6 43.4,21.3 44,20.7 44,19.7 43.9,19.8 43.9,23.8 44.8,24.7 44.9,24.7 44.9,23.2 | 44.9,23.2 44.2,22.5 44.1,22.4 44.1,19.8 44.8,20.5 | 44.8,20.5 44.8,23.4 | 44.8,20.5 44.8,17.4 44,18.2 44,19 44.9,19.9 | 44.9,23.2 44.9,19.9 | 44.9,19.9 44.9,16.2 | 43,18.1 43,21.3 43,23.6
  Bottom 1.422: v39.5,16.3 39.5,17.2 39.7,17.4 40.8,17.4 40.9,17.4 42.1,17.4 43.5,17.4 44.4,17.4 43.48,18.32 X1.1
N$23  (via drill 0.7)
  Top 0.813: IC2.5 30.61,17.89 31.4,17.1 v31.4,16.5
  Bottom 0.813: v31.4,16.5 31.8,16.5 32.2,16.9 32.2,20.1 33.2,21.1 34.77,21.1 R9.1 35.9,22.23 D9.C
N$24
  Bottom 0.61: U$2.G 40.8,9.97 40.8,9.6 40.6,9.8 40.6,10 | 40.6,10 40.9,9.7 40.9,9.5 40.2,9.5 40.3,9.6 40.3,9.9 40.1,9.7 40.1,9.6 39.7,10 39.8,10 40.6,10
  Bottom 0.813: R9.2 36.4,17.83 D9.A 36.74,15.96 38.5,14.2 38.5,11.3 39.8,10
N$25  (via drill 0.7)
  Top 0.61: IC2.7 29.07,20.43 28.4,21.1 v28.4,23.2 | v36.3,25.1 34.85,26.55 R10.1
  Bottom 0.61: 34.76,24.76 D8.C 35.02,25.1 v36.3,25.1
  Bottom 0.813: v28.4,23.2 28.8,23.6 33.6,23.6 34.76,24.76
N$33  (via drill 0.7)
  Top 0.61: LED5.A v12.05,11.8
  Bottom 0.61: R6.2 12.02,11.77 v12.05,11.8
N$34  (via drill 0.7)
  Top 0.61: v12.1,9 11.19,9 LED6.A
  Bottom 0.61: R7.2 12.03,9.07 v12.1,9
N$35  (via drill 0.7)
  Top 0.61: LED7.A 11.26,4.95 v11.95,4.95
  Bottom 0.61: v11.95,4.95 11.88,5.02 R8.2
P1  (via drill 0.7)
  Top 0.61: IC1.12 19.02,8.67 16.5,6.15 14.75,6.15 IC1.5 9.32,6.13 v9.3,6.15
  Bottom 0.61: CON1.3 6.99,8.61 8.2,7.4 | 8.2,7.4 8.2,6.3 9.48,5.02 R8.1 9.57,5.05 | v9.3,6.15 9.3,6.3 8.2,7.4
VB1
  Top 0.254: 31,22.5 30.8,22.3 29.8,22.3 29.8,22 30.3,22.5 31.6,22.5 31.6,23.1
  Top 0.406: 32.3,22.3 32.3,22.4 | 31.7,22.6 32,22.6 | 32.59,21.7 32.5,21.79 32.5,22.2 33,21.7 | 33,21.7 33.2,21.5 | 33,21.7 31.7,21.7
  Top 0.61: 32,22.6 32.3,22.3
  Top 0.813: C10.1 32.59,21.7 31.7,21.7 | 31.7,21.7 IC2.8 | 31.7,21.7 31.7,22.6 31.6,22.7 31.6,23.4 31.55,23.45 31.55,24.55 31.35,24.35 31.35,24.15 33.3,22.2 33.3,21.8 33.25,21.85 33.25,22.2 32.35,23.1 31.6,23.1
  Top 1.422: D2.C 30.4,25.37 30.4,22.5 31,23.1 | 31,23.1 31,24.5 | 31,22.5 31,23.1
VB2
  Top 0.813: IC4.8 34.2,8.71 C7.1 34.85,8.25 34.85,9.2 34.65,9.4 34.65,9.45 33.6,10.5 | D4.C 32.8,10.35 31.7,9.25 31.85,9.25 32,9.4 32,11.45 32.1,11.55 32.1,9.8 32.6,9.3 32.6,9.5 33,9.9 33,9.4 33.15,9.25 33.15,11 33.4,11.25 33.4,10.15 34.2,9.35 33.8,9.35 33.7,9.25 33.7,10.2 33.6,10.3 33.6,10.5 | 33.6,10.5 33.6,11.35